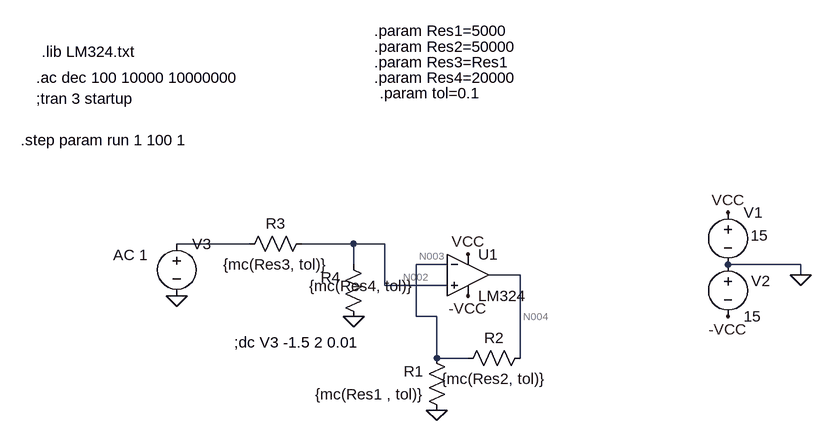
[diagram p0: schematic simulacion_b_montecarlo.asc]
simulacion_b_montecarlo.asc, the LTspice schematic file:
Version 4
SHEET 1 880 680
WIRE -224 80 -336 80
WIRE -64 80 -144 80
WIRE -16 80 -64 80
WIRE -64 112 -64 80
WIRE 80 112 32 112
WIRE 624 112 512 112
WIRE 192 128 144 128
WIRE 624 128 624 112
WIRE -16 144 -16 80
WIRE 80 144 -16 144
WIRE 32 192 32 112
WIRE 64 192 32 192
WIRE 64 256 64 192
WIRE 112 256 64 256
WIRE 192 256 192 128
FLAG 624 128 0
FLAG 512 32 VCC
FLAG 112 96 VCC
FLAG 112 160 -VCC
FLAG 512 192 -VCC
FLAG -336 160 0
FLAG -64 192 0
FLAG 64 336 0
SYMBOL Opamps\\opamp2 112 64 R0
SYMATTR InstName U1
SYMATTR Value LM324
SYMBOL voltage 512 16 R0
WINDOW 3 35 51 Left 2
WINDOW 123 0 0 Left 2
WINDOW 39 0 0 Left 2
SYMATTR Value 15
SYMATTR InstName V1
SYMBOL voltage 512 96 R0
WINDOW 0 36 41 Left 2
WINDOW 123 0 0 Left 2
WINDOW 39 0 0 Left 2
SYMATTR InstName V2
SYMATTR Value 15
SYMBOL voltage -336 64 R0
WINDOW 123 -98 33 Left 2
WINDOW 39 0 0 Left 2
SYMATTR Value2 AC 1
SYMATTR Value ""
SYMATTR InstName V3
SYMBOL res 80 352 R180
WINDOW 0 36 76 Left 2
WINDOW 3 36 40 Left 2
SYMATTR InstName R1
SYMATTR Value {mc(Res1 , tol)}
SYMBOL res 208 240 R90
WINDOW 0 0 56 VBottom 2
WINDOW 3 32 56 VTop 2
SYMATTR InstName R2
SYMATTR Value {mc(Res2, tol)}
SYMBOL res -240 96 R270
WINDOW 0 32 56 VTop 2
WINDOW 3 0 56 VBottom 2
SYMATTR InstName R3
SYMATTR Value {mc(Res3, tol)}
SYMBOL res -48 208 R180
WINDOW 0 36 76 Left 2
WINDOW 3 -76 63 Left 2
SYMATTR InstName R4
SYMATTR Value {mc(Res4, tol)}
TEXT -552 -144 Left 2 !;tran 3 startup
TEXT -544 -216 Left 2 !.lib LM324.txt
TEXT -552 -176 Left 2 !.ac dec 100 10000 10000000
TEXT -32 -248 Left 2 !.param Res1=5000
TEXT -32 -224 Left 2 !.param Res2=50000
TEXT -32 -200 Left 2 !.param Res3=Res1
TEXT -32 -176 Left 2 !.param Res4=20000
TEXT -248 232 Left 2 !;dc V3 -1.5 2 0.01
TEXT -24 -152 Left 2 !.param tol=0.1
TEXT -576 -80 Left 2 !.step param run 1 100 1

The netlist it stands for:
* simulacion_b_montecarlo.asc
XU1 N002 N003 VCC -VCC N004 LM324  ; pins In+ In- V+ V- OUT
V1 VCC 0 15
V2 0 -VCC 15
V3 N001 0 AC 1
R1 0 N003 {mc(Res1 , tol)}
R2 N004 N003 {mc(Res2, tol)}
R3 N001 N002 {mc(Res3, tol)}
R4 0 N002 {mc(Res4, tol)}
;tran 3 startup
.lib LM324.txt
.ac dec 100 10000 10000000
.param Res1=5000
.param Res2=50000
.param Res3=Res1
.param Res4=20000
;dc V3 -1.5 2 0.01
.param tol=0.1
.step param run 1 100 1
.backanno
.end

* Results of the author's LTspice run, read from the files saved beside the schematic
* Operating Point (first step), zero values left out:
*   run = 1 
*   V(n004) = -9.783 µV
*   V(-vcc) = -15 V
*   V(vcc) = 15 V
*   V(n003) = 42.9 µV
*   V(n002) = 76.56 µV
*   I(R4) = -3.605 nA
*   I(R3) = -16.31 nA
*   I(R2) = -10.4 nA
*   I(R1) = -9.53 nA
*   I(V3) = 16.31 nA
*   I(V2) = -999.7 µA
*   I(V1) = -999.8 µA
*   Ix(u1:1) = -19.92 nA
*   Ix(u1:2) = -19.93 nA
*   Ix(u1:3) = 999.8 µA
*   Ix(u1:4) = -999.7 µA
*   Ix(u1:5) = 10.4 nA